# Altium schematic sheet MCU.SchDoc: Title
size A4; Date: *******; ApprovedBy: *******; CheckedBy: None; Author: *******; CompanyName: *******; DrawnBy: Name; Engineer: *******; Organization: *******; Address1: *******; Address2: *******; Address3: *******; Address4: *******; DocumentNumber: Doc Num; Revision: *******; SheetNumber: 5; SheetTotal: 9; Subtitle: Subtitle; Project: Project; VersionRevision: VersionRevision; TotalSheet: TotalSheet; CurrentTime: *******; CurrentDate: *******; Time: *******; DocumentFullPathAndName: *******; DocumentName: *******; ModifiedDate: *******; ImagePath: *******; ProjectName: *******; Application_BuildNumber: *******
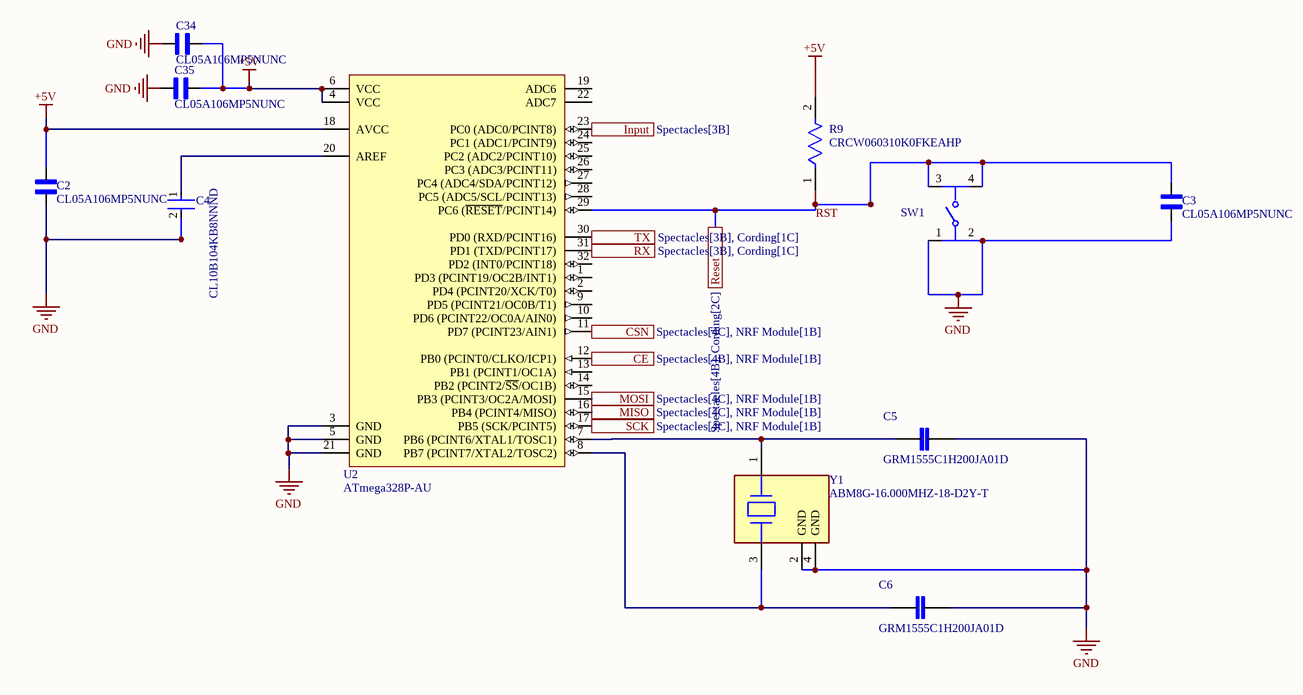
[diagram p0: MCU.SchDoc]

## Parts
C2  CL05A106MP5NUNC  [CAPC1005X55N]
C3  CL05A106MP5NUNC  [CAPC1005X55N]
C4  CL10B104KB8NNND  [FP-CL10-IPC_A]
C5  GRM1555C1H200JA01D  [CAPC1005X55N]
C6  GRM1555C1H200JA01D  [CAPC1005X55N]
C34  CL05A106MP5NUNC  [CAPC1005X55N]
C35  CL05A106MP5NUNC  [CAPC1005X55N]
R9  CRCW060310K0FKEAHP  [FP-CRCW0603-HPe3-MFG]
SW1  PTS526SK15SMTR2LFS  [FP-PTS526SK15SMTR2LFS-MFG]  (value not drawn)
U2  ATmega328P-AU  [32A_M]
Y1  ABM8G-16.000MHZ-18-D2Y-T  [FP-ABM8G-MFG]

## Ports
CE (see Spectacles[4B], NRF Module[1B]), CSN (see Spectacles[4C], NRF Module[1B]), Input (see Spectacles[3B]), MISO (see Spectacles[4C], NRF Module[1B]), MOSI (see Spectacles[4C], NRF Module[1B]), Reset (see Spectacles[4B], Cording[2C]), RX (see Spectacles[3B], Cording[1C]), SCK (see Spectacles[4C], NRF Module[1B]), TX (see Spectacles[3B], Cording[1C])

## Nets
+5V: C2.2 C34.1 C35.1 R9.2 U2.4(VCC) U2.6(VCC) U2.18(AVCC)
GND: C2.1 C3.1 C4.2 C5.1 C6.1 C34.2 C35.2 SW1.1 SW1.2 U2.3(GND) U2.5(GND) U2.21(GND) Y1.2(GND) Y1.4(GND)
CE: U2.12(PB0_(PCINT0/CLKO/ICP1)) ; port CE
CSN: U2.11(PD7_(PCINT23/AIN1)) ; port CSN
Input: U2.23(PC0_(ADC0/PCINT8)) ; port Input
MISO: U2.16(PB4_(PCINT4/MISO)) ; port MISO
MOSI: U2.15(PB3_(PCINT3/OC2A/MOSI)) ; port MOSI
RST: C3.2 R9.1 SW1.3 SW1.4 U2.29(PC6_(~{RESET}/PCINT14)) ; port Reset
RX: U2.31(PD1_(TXD/PCINT17)) ; port RX
SCK: U2.17(PB5_(SCK/PCINT5)) ; port SCK
TX: U2.30(PD0_(RXD/PCINT16)) ; port TX
NetC4_1: C4.1 U2.20(AREF)
NetC5_2: C5.2 U2.7(PB6_(PCINT6/XTAL1/TOSC1)) Y1.1
NetC6_2: C6.2 U2.8(PB7_(PCINT7/XTAL2/TOSC2)) Y1.3

Not connected (* = marked no-connect by the designer): U2 1(PD3_(PCINT19/OC2B/INT1)) 2(PD4_(PCINT20/XCK/T0)) 9(PD5_(PCINT21/OC0B/T1)) 10(PD6_(PCINT22/OC0A/AIN0)) 13(PB1_(PCINT1/OC1A)) 14(PB2_(PCINT2/~{SS}/OC1B)) 19(ADC6) 22(ADC7) 24(PC1_(ADC1/PCINT9)) 25(PC2_(ADC2/PCINT10)) 26(PC3_(ADC3/PCINT11)) 27(PC4_(ADC4/SDA/PCINT12)) 28(PC5_(ADC5/SCL/PCINT13)) 32(PD2_(INT0/PCINT18))

## Notes on the sheet
- Title:
- Drawn By:
- Page Contents:
- Checked By:
- Subtitle:
- University Of Moratuwa
- Moratuwa
- Size:
- Date:
- File:
- Email:
- A4
- lasithnawanjaan123@gmail.com
- Lasith Haputhanthri
- Number:
- Time:
- Revision:
- Sheet
- of
- Katubedda
- 10500
- Sri Lanka

## Library data of the parts
C2 C3 C34 C35 = CL05A106MP5NUNC: 10 ÂµF Â±20% 10V Ceramic Capacitor X5R 0402 (1005 Metric); Manufacturer Part Number: GRM188R61A106KE69D; Manufacturer: Murata; Temperature Coefficient: 15%; Capacitance: 10uF; Tolerance: 10%; MF: Samsung Electro-Mechanics; Package: 0402 Samsung; Value: *; Device Class L1: Passive Components; ComponentLink2Description: Datasheet; Height: 0.95mm; Octopart: https://octopart.com/grm188r61a106ke69d-murata-22851381; Digikey Description: CAP CER 10UF 10V X5R 0603; Temperature Range High: +85°C; Temperature Range Low: -55°C; Temperature Characteristic: X5R; RoHS: TRUE; Material: Ceramic; Device Class L2: Capacitors; ComponentLink2URL: https://search.murata.co.jp/Ceramy/image/img/A01X/G101/ENG/GRM188R61A106KE69-01A.pdf; Device Class L3: Ceramic Capacitors; Lead Free: Yes; Mouser Description: Multilayer Ceramic Capacitors MLCC - SMD/SMT 0603 10uF 10volts X5R + - 10%; Category: Cap; Voltage Rating: 10V; Temperature: -55°C to +85°C; Automotive: No; Check_prices: https://www.snapeda.com/parts/CL05A106MP5NUNC/Samsung+Electro-Mechanics/view-part/?ref=eda; MP: CL05A106MP5NUNC; SnapEDA_Link: https://www.snapeda.com/parts/CL05A106MP5NUNC/Samsung+Electro-Mechanics/view-part/?ref=snap
C4 = CMP-13271-000587-1: Cap Ceramic 100nF 50V X7R ±10% Pad SMD 0603 +125°C T/R; Case/Package: 0603; Depth: 0.8mm; Max Operating Temperature: 125°C; Lead Free: Lead Free; Material: Ceramic; Voltage Rating: 50V; Min Operating Temperature: -55°C; Voltage Rating (DC): 50V; Dielectric: X7R; Height: 0.8mm; Capacitance: 100nF; Thickness: 0.035inch; Radiation Hardening: No; Voltage: 50V; Packaging: Tape and Reel; Length: 1.6mm; Tolerance: 10%; Width: 0.031inch; Mount: Surface Mount; Package Quantity: 10000
C5 C6 = GRM1555C1H200JA01D: SMD Capacitor C0G(EIA) with Capacitance: 20pF Tol. 5%. Rated Voltage: 50Vdc; MF: Murata; Check_prices: https://www.snapeda.com/parts/GRM1555C1H200JA01D/Murata+Electronics+North+America/view-part/?ref=eda; MP: GRM1555C1H200JA01D; Package: 1005 Taiyo Yuden; SnapEDA_Link: https://www.snapeda.com/parts/GRM1555C1H200JA01D/Murata+Electronics+North+America/view-part/?ref=snap; Value: *
R9 = CMP-2000-03835-2: RES SMD 10K OHM 1% 1/3W 0603; Resistance: 10kR; Voltage Rating (DC): 75V; Max Power Dissipation: 250mW; Temperature Coefficient: 100ppm/°C; Case Code (Metric): 1608; Features: Automotive AEC-Q200; Termination: SMD/SMT; Number of Terminations: 2; Case Code (Imperial): 0603; Tolerance: 1%; Depth: 0.85mm; Package Quantity: 10; Length: 1.6mm; Packaging: Tape and Reel; Contact Plating: Tin; Radiation Hardening: No; Case/Package: 0603; Composition: Thick Film; Voltage Rating: 75V; Weight: 7.1E-05oz; Max Operating Temperature: 155°C; Lead Free: Lead Free; Width: 0.033inch; Power Rating: 250mW; Min Operating Temperature: -55°C; Military Standard: Not; Height: 0.45mm
SW1 = CMP-10040-000013-1: TACT 5.2 X 5.2, 1.5 MM H, 260GF,; Manufacturer: C&K; Operating Force: 250gf; Throw Configuration: SPST-NO; Contact Current Rating: 50mA; Standoff Height: 0mm; Contact Resistance: 100mΩ; Voltage Rating Dc: 12V; Electromechanical Life: 200000Cycles; Device Class L3: Tactile Switches; Device Class L2: Switches; Temperature: -20°C to +70°C; Temperature Range Low: -20°C; Package: PTS526SK15SMTR2LFS; Temperature Range High: +70°C; ComponentLink2Description: Datasheet; Device Class L1: Electromechanical; Height: 1.65mm; Digikey Description: TACT 5.2 X 5.2, 1.5 MM H, 260GF,; Category: Switch; RoHS: TRUE; Automotive: No; Lead Free: Yes; Manufacturer Part Number: PTS526SK15SMTR2LFS; Octopart: https://octopart.com/pts526+sk15+smtr2+lfs-c%26k+components-100617999; ComponentLink2URL: https://www.ckswitches.com/media/2780/pts526.pdf
U2 = CMP-0095-00269-2: 8-bit AVR Microcontroller, 32KB Flash, 1KB EEPROM, 2KB SRAM, 32-pin TQFP, Industrial Grade (-40°C to 85°C); PackageDescription: 32-Lead, 7x7x1.0 mm Body, 0.8mm Lead Pitch, Thin Profile Plastic Quad Flat Package (TQFP); DatasheetVersion: revD, May-2011; RevisionNote: DatasheetVersion & PackageVersion updated. URLs added.; ComponentLink1URL: http://www.atmel.com/; ComponentLink2Description: ATmega48A/48PA/88A/88PA/168A/168PA/328/328P Datasheet; Code_JEDEC: MS-026-ABA; ComponentLink1Description: Manufacturer URL; PackageReference: 32A; ComponentLink3Description: ATmega48A/48PA/88A/88PA/168A/168PA/328/328P Summary; ComponentLink2URL: http://www.atmel.com/dyn/resources/prod_documents/doc8271.pdf; PackageVersion: revC, Oct-2010; ComponentLink3URL: http://www.atmel.com/dyn/resources/prod_documents/8271S.pdf
Y1 = CMP-2000-05039-3: Crystal 12MHz ±20ppm (Tol) ±30ppm (Stability) 18pF FUND 120Ω 4-Pin SMD T/R; Series Resistance: 120R; Max Operating Temperature: 85°C; Mount: Surface Mount; Width: 2.5mm; Series: ABM8G; Termination: SMD/SMT; Frequency Tolerance: 20ppm; Tolerance: 20ppm; Min Operating Temperature: -40°C; Operating Frequency: 12 MHz; Depth: 2.5mm; Load Capacitance: 18pF; Number of Pins: 4; Length: 3.2mm; Radiation Hardening: No; Frequency Stability: 30ppm; Height: 1mm; Packaging: Tape and Reel; Package Quantity: 1000; ESR (Equivalent Series Resistance): 120R; Lead Free: Lead Free; Frequency: 12MHz; Case/Package: CSMD